# Altium project L293.PrjPCB
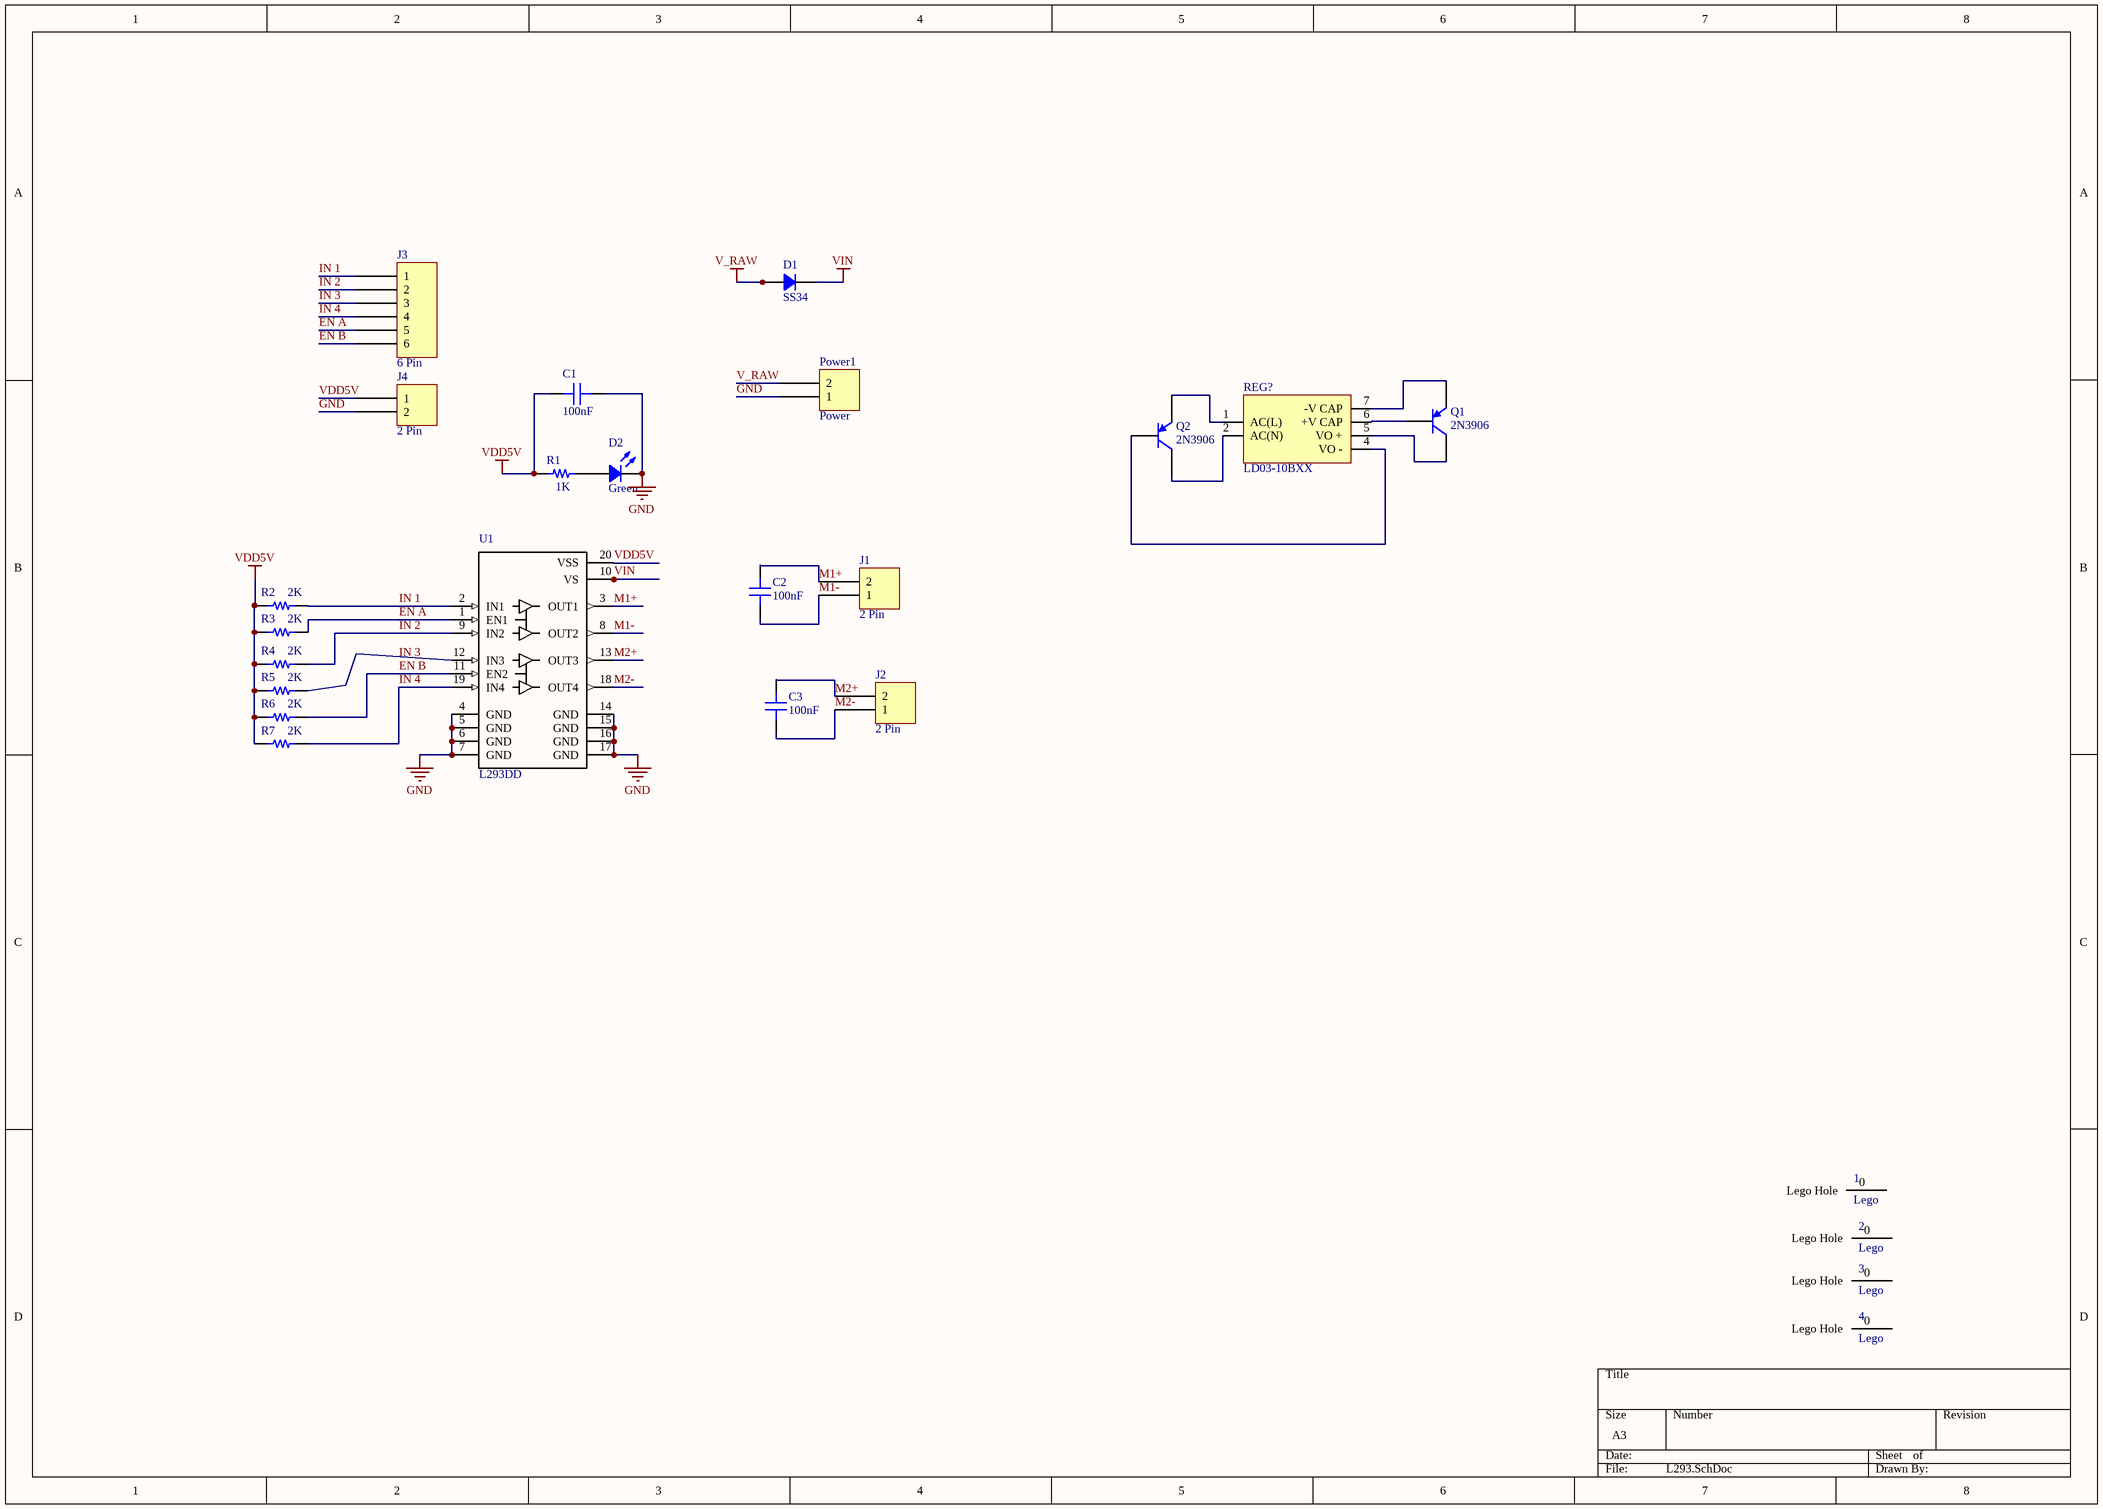
[diagram p0: L293.SchDoc]
1 sheet, 25 parts. Net scope: global (net labels, ports and power ports of the same name join across sheets).
Board file: L293.PcbDoc

## Sheet L293.SchDoc
size A3

### Parts
1  Lego  [Lego Hole]
2  Lego  [Lego Hole]
3  Lego  [Lego Hole]
4  Lego  [Lego Hole]
C1  100nF  [CAP 1206/3216]
C2  100nF  [CAP 1206/3216]
C3  100nF  [CAP 1206/3216]
D1  SS34  [DO214AC SMA]
D2  Green  [LED 1206/3216 RED]
J1  2 Pin  [TE 282834-2]
J2  2 Pin  [TE 282834-2]
J3  6 Pin  [HDR 1X6]
J4  2 Pin  [HDR 1X2]
Power1  Power  [TE 282834-2]
Q1  2N3906  [TO-92A]
Q2  2N3906  [TO-92A]
R1  1K  [RES 1206/3216]
R2  2K  [RES 1206/3216]
R3  2K  [RES 1206/3216]
R4  2K  [RES 1206/3216]
R5  2K  [RES 1206/3216]
R6  2K  [RES 1206/3216]
R7  2K  [RES 1206/3216]
REG?  LD03-10BXX  [LD03]
U1  L293DD  [SOIC127P1030-20N]

### Nets
GND: C1.1 D2.2 J4.2 Power1.1 U1.4(GND) U1.5(GND) U1.6(GND) U1.7(GND) U1.14(GND) U1.15(GND) U1.16(GND) U1.17(GND)
V_RAW: D1.1 Power1.2
VDD5V: C1.2 J4.1 R1.2 R2.2 R3.2 R4.2 R5.2 R6.2 R7.2 U1.20(VSS)
VIN: D1.2 U1.10(VS)
EN A: J3.5 R3.1 U1.1(EN1)
EN B: J3.6 R6.1 U1.11(EN2)
IN 1: J3.1 R2.1 U1.2(IN1)
IN 2: J3.2 R4.1 U1.9(IN2)
IN 3: J3.3
IN 4: J3.4 R7.1 U1.19(IN4)
M1+: C2.2 J1.2 U1.3(OUT1)
M1-: C2.1 J1.1 U1.8(OUT2)
M2+: C3.2 J2.2 U1.13(OUT3)
M2-: C3.1 J2.1 U1.18(OUT4)
NetD2_1: D2.1 R1.1
NetQ1_1: Q1.1(E) REG?.7(-V_CAP)
NetQ1_2: Q1.2(B) REG?.6(+V_CAP)
NetQ1_3: Q1.3(C) REG?.5(VO_+)
NetQ2_1: Q2.1(E) REG?.1(AC(L))
NetQ2_2: Q2.2(B) REG?.4(VO_-)
NetQ2_3: Q2.3(C) REG?.2(AC(N))
NetR5_1: R5.1 U1.12(IN3)

Not connected (* = marked no-connect by the designer): 1 0(Lego_Hole); 2 0(Lego_Hole); 3 0(Lego_Hole); 4 0(Lego_Hole)

### Notes on the sheet
- Labels drawn without touching a wire or pin: IN 3

### Library data of the parts
C1-C3 = Capacitor: SMT Capacitor; Value: 0.1uF
D1 = Diode: Rectifier Diode
D2 = LED: Chip LED; Value: Green
Power1 = 2 Pin
Q1 Q2 = 2N3906: PNP General Purpose Amplifier; Published: 8-Jun-2000; LatestRevisionDate: 15-Jan-2003; LatestRevisionNote: PCB Footprint 'BCY-W3/D4.7' replaced; DatasheetVersion: 1997; PackageVersion: Sep-1998; PackageReference: TO-92A; Publisher: Altium Limited; PackageDescription: TO, Flat Index; 3 In-Line, Axial Leads; Body Dia. 4.5mm; Leads 0.51 x 0.48 mm (max); ComponentLink1Description: Manufacturer Link; ComponentLink1URL: http://www.fairchildsemi.com/; ComponentLink2Description: Datasheet; ComponentLink2URL: http://www.fairchildsemi.com/ds/2N%2F2N3906.pdf
R1 = Resistor: SMT Resistor; Value: 1K
R2-R7 = Resistor: SMT Resistor; Value: 1K
REG? = LD03-10BXX: AD-DC REGULATOR
U1 = L293DD: IC MOTOR DRIVER PAR 20-SOIC; MF: STMicroelectronics; Availability: Good; Price: 3.02 USD; Package: SOIC-20 STMicroelectronics; MP: L293DD; Value: *